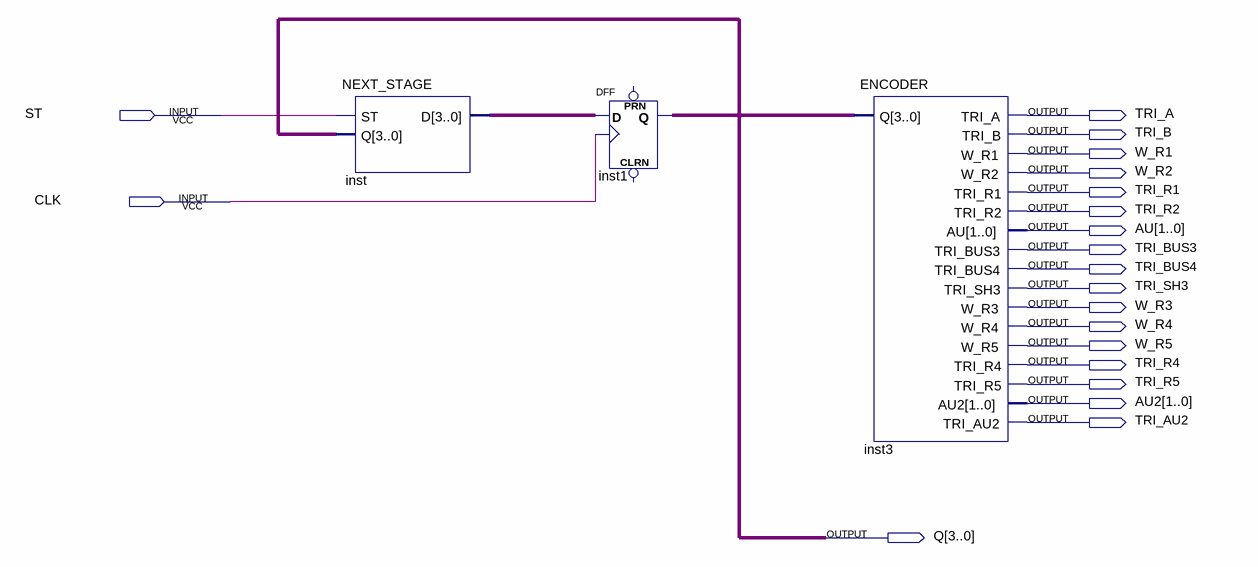
[diagram p0: schematic sheet]
// Quartus schematic CONTROLLER.bdf as structural Verilog: 3 symbols, 20 pins
module CONTROLLER (
  input  ST,
  input  CLK,
  output TRI_A,
  output TRI_B,
  output W_R1,
  output W_R2,
  output TRI_R1,
  output TRI_R2,
  output [1:0] AU,
  output TRI_BUS3,
  output TRI_BUS4,
  output TRI_SH3,
  output W_R3,
  output W_R4,
  output W_R5,
  output TRI_R4,
  output TRI_R5,
  output [1:0] AU2,
  output TRI_AU2,
  output [3:0] Q
);

  wire [3:0] inst_d;

  NEXT_STAGE inst (.ST(ST), .Q(Q), .D(inst_d));
  DFF inst1[3:0] (.CLK(CLK), .D(inst_d), .Q(Q));  // open: CLRN, PRN
  ENCODER inst3 (
    .Q(Q), .TRI_A(TRI_A), .TRI_B(TRI_B), .W_R1(W_R1), .W_R2(W_R2), .TRI_R1(TRI_R1), .TRI_R2(TRI_R2), .AU(AU),
    .TRI_BUS3(TRI_BUS3), .TRI_BUS4(TRI_BUS4), .TRI_SH3(TRI_SH3), .W_R3(W_R3), .W_R4(W_R4), .W_R5(W_R5),
    .TRI_R4(TRI_R4), .TRI_R5(TRI_R5), .AU2(AU2), .TRI_AU2(TRI_AU2));
endmodule
